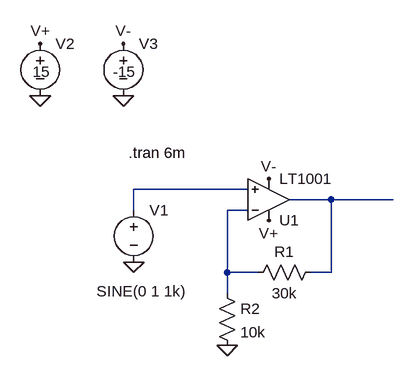
[diagram p0: schematic Ei-invertoivavahvistin.asc]
Ei-invertoivavahvistin.asc, the LTspice schematic file:
Version 4
SHEET 1 880 680
WIRE 304 288 128 288
WIRE 432 304 368 304
WIRE 528 304 432 304
WIRE 128 320 128 288
WIRE 304 320 272 320
WIRE 272 416 272 320
WIRE 320 416 272 416
WIRE 432 416 432 304
WIRE 432 416 400 416
WIRE 272 448 272 416
FLAG -16 144 0
FLAG 112 144 0
FLAG 128 400 0
FLAG 272 528 0
FLAG 336 336 V+
FLAG -16 64 V+
FLAG 336 272 V-
FLAG 112 64 V-
SYMBOL voltage 128 304 R0
WINDOW 3 -57 141 Left 2
WINDOW 123 0 0 Left 2
WINDOW 39 0 0 Left 2
SYMATTR InstName V1
SYMATTR Value SINE(0 1 1k)
SYMBOL voltage -16 48 R0
WINDOW 3 -12 59 Left 2
WINDOW 123 0 0 Left 2
WINDOW 39 0 0 Left 2
SYMATTR InstName V2
SYMATTR Value 15
SYMBOL voltage 112 48 R0
WINDOW 3 -16 59 Left 2
WINDOW 123 0 0 Left 2
WINDOW 39 0 0 Left 2
SYMATTR InstName V3
SYMATTR Value -15
SYMBOL Opamps\\LT1001 336 368 M180
SYMATTR InstName U1
SYMBOL res 416 400 R90
WINDOW 0 0 56 VBottom 2
WINDOW 3 32 56 VTop 2
SYMATTR InstName R1
SYMATTR Value 30k
SYMBOL res 256 432 R0
SYMATTR InstName R2
SYMATTR Value 10k
TEXT 120 232 Left 2 !.tran 6m

The netlist it stands for:
* Ei-invertoivavahvistin.asc
V1 N001 0 SINE(0 1 1k)
V2 V+ 0 15
V3 V- 0 -15
XU1 N001 N003 V+ V- N002 LT1001  ; pins In+ In- V+ V- OUT
R1 N002 N003 30k
R2 N003 0 10k
.tran 6m
.lib LTC.lib
.backanno
.end